# EAGLE design piezo-preamp-tickler_V3-7_single-supply-OPA1642 (EAGLE 8.6.0)

## Sheet 1 of 2
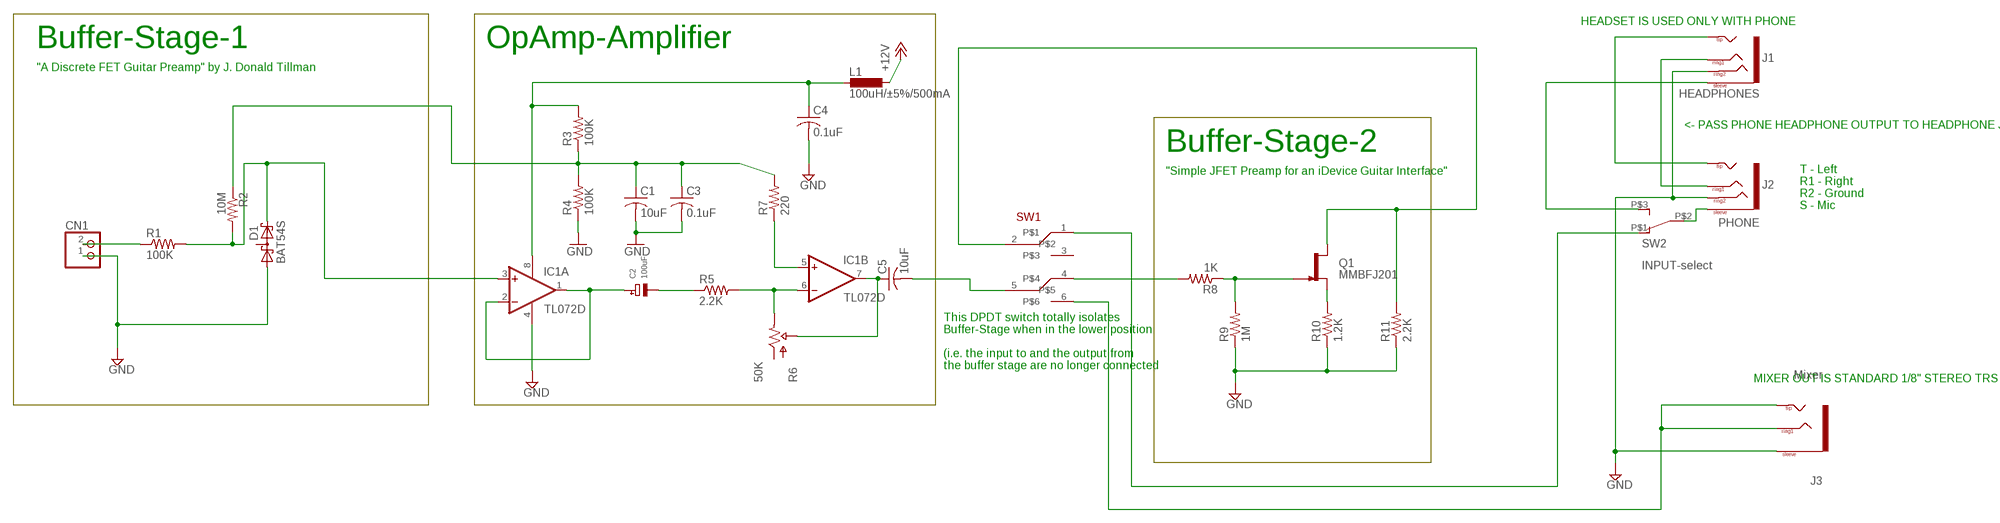
[diagram p0: schematic, sheet 1]

### Parts
C1  10uF  C-USC0805K  [C0805K]
C2  100uF  CAP_TANTALUMD/7343_REFLOW  [EIA7343-31/D-R]
C3  0.1uF  C-USC0805K  [C0805K]
C4  0.1uF  C-USC0805K  [C0805K]
C5  10uF  C-USC0805  [C0805]
CN1  JST_2PIN-THM  [JST-PH-2-THM]
D1  BAT54S  [SOT23]
IC1  TL072D  [SO08]
J1  HEADPHONES  TRRS-1/8"-3.5MMLGPADS  [TRRS_SJ-43514-SMT-TR]
J2  PHONE  TRRS-1/8"-3.5MMLGPADS  [TRRS_SJ-43514-SMT-TR]
J3  Mixer  TRS-1/8"-3.5MM  [TRS_SJ-3524-SMT]
L1  100uH/±5%/500mA  L-EUL3225M  [L3225M]
Q1  MMBFJ201  J201SOT-23  [SOT23-3]
R1  100K  R-US_R0603  [R0603]
R2  10M  R-US_R0603  [R0603]
R3  100K  R-US_R0603  [R0603]
R4  100K  R-US_R0603  [R0603]
R5  2.2K  R-US_R0603  [R0603]
R6  50K  POTTHUMBPOT14  [THUMBPOT14MM]
R7  220  R-US_R0603  [R0603]
R8  1K  R-US_R0603  [R0603]
R9  1M  R-US_R0603  [R0603]
R10  1.2K  R-US_R0603  [R0603]
R11  2.2K  R-US_R0603  [R0603]
SW1  SWITCH_DPDT  [SWITCH_DPDT_CL-SB-22B]
SW2  INPUT-select  SWITCH_SPDTCL-SB-12B  [SWITCH_SPDT_CL-SB-12B]

### Nets
+12V: L1.1 ; also sheet 2
GND: C1.2 C3.2 C4.2 CN1.1 D1.1(A1) IC1.4(P:V-) J1.RING2 J2.RING2 J3.1(SLEEVE) R4.1 R9.1 R10.1 R11.1 ; also sheet 2
N$1: D1.2(C2) IC1.3(A:+IN) R1.2 R2.2
N$2: CN1.2 R1.1
N$3: Q1.2(S) R10.2
N$4: J1.EARTH(SLEEVE) SW2.P$3
N$5: IC1.5(B:+IN) R7.1
N$6: C5.1 IC1.7(B:OUT) R6.P$2(WIPER)
N$7: IC1.6(B:-IN) R5.2 R6.P$3(OUT)
N$8: C4.1 IC1.8(P:V+) L1.2 R3.2
N$9: C1.1 C3.1 R2.1 R3.1 R4.2 R7.2
N$10: Q1.3(G) R8.1 R9.2
N$11: R8.2 SW1.4
N$12: J3.2(TIP) J3.3(RING1) J3.4(TIP) SW1.6
N$13: J1.RING1 J2.RING1
N$14: C2.- R5.1
N$16: C5.2 SW1.5
N$17: J2.EARTH(SLEEVE) SW2.P$2
N$19: SW1.1 SW2.P$1
N$24: C2.+ IC1.1(A:OUT) IC1.2(A:-IN)
N$33: J1.TIP J2.TIP
SELECT: Q1.1(D) R11.2 SW1.2
Unconnected: D1.3(C1A2) R6.P$1(IN) SW1.3

### Notes on the sheet
- HEADSET IS USED ONLY WITH PHONE
- Buffer-Stage-1 | OpAmp-Amplifier
- "A Discrete FET Guitar Preamp" by J. Donald Tillman
- <- PASS PHONE HEADPHONE OUTPUT TO HEADPHONE JACK
- Buffer-Stage-2
- "Simple JFET Preamp for an iDevice Guitar Interface"
- T - Left
  R1 - Right
  R2 - Ground
  S - Mic
- This DPDT switch totally isolates 
  Buffer-Stage when in the lower position
  
  (i.e. the input to and the output from 
  the buffer stage are no longer connected
- MIXER OUT IS STANDARD 1/8" STEREO TRS

## Sheet 2 of 2
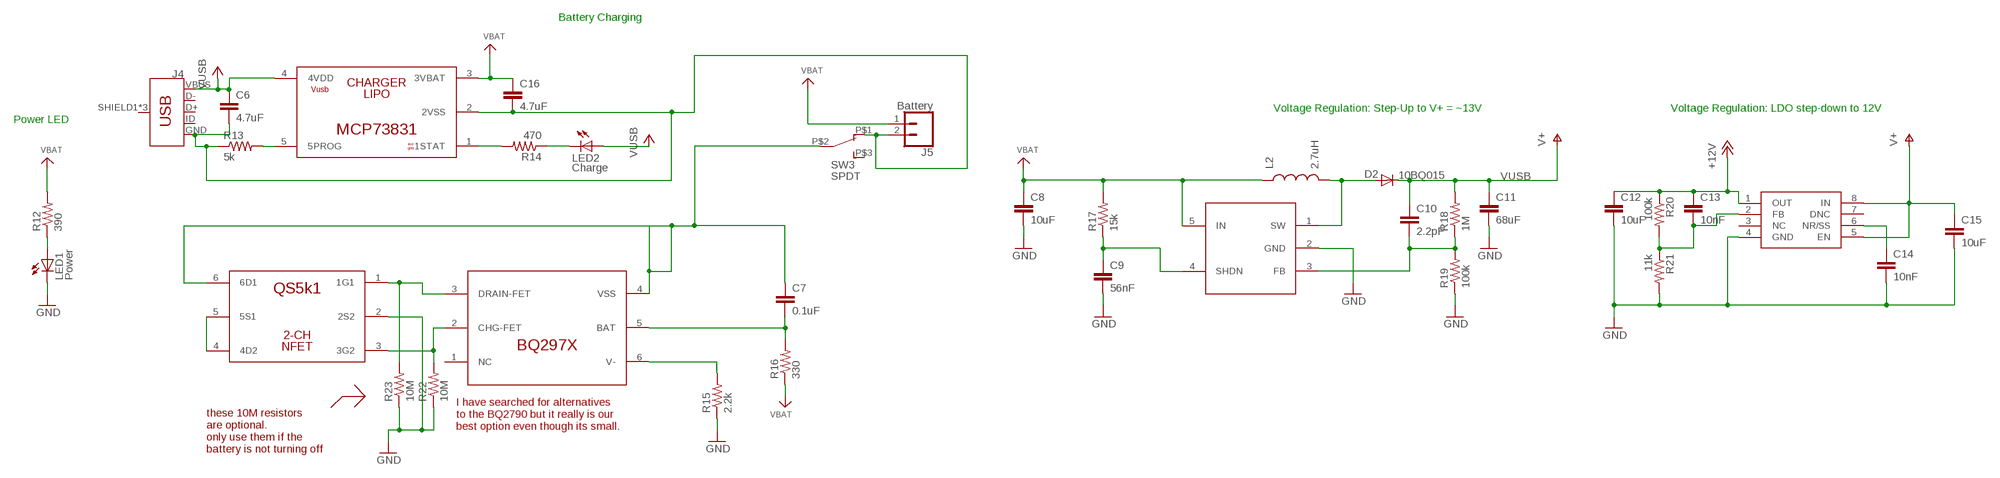
[diagram p1: schematic, sheet 2]

### Parts
C6  4.7uF  C-EUC0603  [C0603]
C7  0.1uF  C-EUC0603  [C0603]
C8  10uF  C-EUC0603  [C0603]
C9  56nF  C-EUC0603  [C0603]
C10  2.2pF  C-EUC0603  [C0603]
C11  68uF  C-EUC1206  [C1206]
C12  10uF  C-EUC0603  [C0603]
C13  10nF  C-EUC0603  [C0603]
C14  10nF  C-EUC0603  [C0603]
C15  10uF  C-EUC0603  [C0603]
C16  4.7uF  C-EUC0603  [C0603]
D2  10BQ015  DIODESMA  [SMA-DIODE]
IC2  MCP73831  [SOT-23-5]
IC3  QS6K1  [SOT457R_PHILIPS]
IC4  BQ297X  BQ297X-BATTERY-MANAGERLONG  [WSON-6-LONG]
IC5  SC4503  [SOT23-5]
IC6  TPS7A49  [MSOP-8]
J4  USB_MICRO-BREDUCED_PASTE  [USB-B-MICRO-SMD_RED_PASTE]
J5  Battery  CONN_02LOCK  [1X02_LOCK]
L2  2.7uH  INDUCTORCR54  [CR54]
LED1  Power  LED3MM  [LED3MM]
LED2  Charge  LED3MM  [LED3MM]
R12  390  R-US_R0603  [R0603]
R13  5k  R-US_R0603  [R0603]
R14  470  R-US_R0603  [R0603]
R15  2.2k  R-US_R0603  [R0603]
R16  330  R-US_R0603  [R0603]
R17  15k  R-US_R0603  [R0603]
R18  1M  R-US_R0603  [R0603]
R19  100k  R-US_R0603  [R0603]
R20  100k  R-US_R0603  [R0603]
R21  11k  R-US_R0603  [R0603]
R22  10M  R-US_R0603  [R0603]
R23  10M  R-US_R0603  [R0603]
SW3  SPDT  SWITCH_SPDTCL-SB-12B  [SWITCH_SPDT_CL-SB-12B]

### Nets
+5V: C6.1 IC2.4(4VDD) J4.VBUS LED2.A ; supply symbol labelled VUSB
+12V: C12.1 C13.1 IC6.1(OUT) R20.1 ; also sheet 1
BATGND: C7.1 IC3.6(6D1) IC4.4(VSS) SW3.P$2
GND: C8.2 C9.2 C11.2 C12.2 C14.2 C15.2 IC3.2(2S2) IC5.2(GND) IC6.4(GND) LED1.K(C) R15.1 R19.1 R21.2 R22.1 R23.1 ; also sheet 1
N$18: LED1.A R12.1
N$21: IC2.5(5PROG) R13.2
N$22: LED2.K(C) R14.1
N$23: IC3.4(4D2) IC3.5(5S1)
N$25: IC2.1(1STAT) R14.2
N$26: C13.2 IC6.2(FB) R20.2 R21.1
N$27: IC3.1(1G1) IC4.3(DRAIN-FET) R23.2
N$28: C14.1 IC6.6(NR/SS)
N$29: C9.1 IC5.4(SHDN) R17.1
N$30: C10.2 IC5.3(FB) R18.1 R19.2
N$31: IC3.3(3G2) IC4.2(CHG-FET) R22.2
N$32: D2.A IC5.1(SW) L2.P$2
N$34: IC4.6(V-) R15.2
N$42: C7.2 IC4.5(BAT) R16.2
USBGND: C6.2 C16.2 IC2.2(2VSS) J4.GND J5.2 R13.1 SW3.P$1
VBAT: C8.1 C16.1 IC2.3(3VBAT) IC5.5(IN) J5.1 L2.P$1 R12.2 R16.1 R17.2
VUSB: C10.1 C11.1 C15.1 D2.C IC6.5(EN) IC6.8(IN) R18.2 ; supply symbol labelled V+
Unconnected: IC4.1(NC) IC6.3(NC) IC6.7(DNC) J4.D+ J4.D- J4.ID J4.SHIELD1(SHIELD) J4.SHIELD2(SHIELD) J4.SHIELD3(SHIELD) SW3.P$3

### Notes on the sheet
- Battery Charging
- Voltage Regulation: Step-Up to V+ = ~13V | Voltage Regulation: LDO step-down to 12V
- Power LED
- I have searched for alternatives 
  to the BQ2790 but it really is our 
  best option even though its small.
- these 10M resistors
  are optional. 
  only use them if the 
  battery is not turning off

## Library data of the parts
C1 C3-C5 = adafruit:C-US: CAPACITOR, American symbol
C2 = microbuilder:CAP_TANTALUM: Tantalum Capacitors Wave footprints have larger pads and are meant to be used for hand soldering. Reflow footprints are optimised for solder paste and a reflow oven. EIA3216-18/A-[R/W] - Size A / 3216-18 / 1206 footprint 4.7µF 25V 10% Tantalum Capacitor 10µF 16V 10% Tantalum Capacitor [Digikey: 495-2236-2-ND] EIA3528-21/B-[R/W] - Size B / 3528-21 47µF 10V 10% Tantalum Capactior [Digikey: 495-2216-1-ND] EIA6032-28/C-[R/W] - Size C / 6032-28 10µF 35V 20% Tantalum Capacitor [Digikey: 495-2285-1-ND] 100µF 16V 10% Tantalum Capactior [Digikey: 399-5214-1-ND]
C6-C16 = rcl:C-EU: CAPACITOR, European symbol; SPICEPREFIX: C
CN1 = adafruit:JST_2PIN: JST 2-Pin Connectors of various flavors SMT-RA (S2B-PH-SM4) 4UConnector #17311 SMT (B2B-PH-SM4) THM-RA (S2B-PH) THM (B2B-PH)
D1 = diode:BAT54S: Schottky Diodes Pin connection corrected 2011-05-04 Source: Fairchild .. BAT54.pdf
D2 = SparkFun:DIODE: Diode These are standard reverse protection diodes and small signal diodes. SMA package can handle up to about 1A. SOD-323 can handle about 200mA. What the SOD-323 package when ordering, there are some mfgs out there that are 5-pin packages.
IC1 = linear:TL072: OP AMP
IC2 = CMU-ArtFab:MCP73831
IC3 = CMU-ArtFab:QS6K1
IC4 = CMU-ArtFab:BQ297X-BATTERY-MANAGER
IC5 = CMU-ArtFab:SC4503
IC6 = CMU-ArtFab:TPS7A49
J1 J2 = CMU-ArtFab:TRRS-1/8"-3.5MM: Audio jack - 3.5mm TRRS variety - two rings.
J3 = CMU-ArtFab:TRS-1/8"-3.5MM
J4 = CMU-ArtFab:USB_MICRO-B: USB Type Micro-B Connector Male/female and PTH/SMT variants SparkFun Products: SparkFun microB USB Breakout <https://www.sparkfun.com/products/12035> SparkFun USB microB Plug Breakout <https://www.sparkfun.com/products/10031> SparkFun ESP8266 Thing <https://www.sparkfun.com/products/13231>; PROD_ID: CONN-11752
J5 = SparkFun-Connectors:CONN_02: Multi connection point. Often used as Generic Header-pin footprint for 0.1 inch spaced/style header connections On any of the 0.1 inch spaced packages, you can populate with these: Break Away Headers - Straight <https://www.sparkfun.com/products/116> (PRT-00116) Break Away Male Headers - Right Angle <https://www.sparkfun.com/products/553> (PRT-00553) Female Headers <https://www.sparkfun.com/products/115> (PRT-00115) Break Away Headers - Machine Pin <https://www.sparkfun.com/products/117> (PRT-00117) Break Away Female Headers - Swiss Machine Pin <https://www.sparkfun.com/products/743> (PRT-00743) For SCREWTERMINALS and SPRING TERMINALS visit here: Screw Terimnals on SparkFun.com <https://www.sparkfun.com/search/results?term=Screw+Terminals> (5mm/3.5mm/2.54mm spacing) This device is also useful as a general connection point to wire up your design to another part of your project. Our various solder wires solder well into these plated through hole pads. Hook-Up Wire - Assortment (Stranded, 22 AWG) <https://www.sparkfun.com/products/11375> (PRT-11375) Hook-Up Wire - Assortment (Solid Core, 22 AWG) <https://www.sparkfun.com/products/11367> (PRT-11367) View the entire wire category on our website here <https://www.sparkfun.com/categories/141> Special notes: Molex polarized connector foot print use with: PRT-08233 with associated crimp pins and housings. 2.54_SCREWTERM for use with PRT-10571. 3.5mm Screw Terminal footprints for PRT-08084 5mm Screw Terminal footprints for use with PRT-08432
L1 = rcl:L-EU: INDUCTOR, European symbol; SPICEPREFIX: L
L2 = SparkFun-Passives:INDUCTOR: Inductors Basic Inductor/Choke - 0603 and 1206. Footprints are not proven and vary greatly between part numbers. SRN6045- 33uH, 20% 1.4A SDR0403-560KL - 56uH, 10%, 500mA RMS/740mA peak
LED1 LED2 = led:LED: LED OSRAM: - CHIPLED LG R971, LG N971, LY N971, LG Q971, LY Q971, LO R971, LY R971 LH N974, LH R974 LS Q976, LO Q976, LY Q976 LO Q996 - Hyper CHIPLED LW Q18S LB Q993, LB Q99A, LB R99A - SideLED LS A670, LO A670, LY A670, LG A670, LP A670 LB A673, LV A673, LT A673, LW A673 LH A674 LY A675 LS A676, LA A676, LO A676, LY A676, LW A676 LS A679, LY A679, LG A679 - Hyper Micro SIDELED® LS Y876, LA Y876, LO Y876, LY Y876 LT Y87S - SmartLED LW L88C, LW L88S LB L89C, LB L89S, LG L890 LS L89K, LO L89K, LY L89K LS L896, LA L896, LO L896, LY L896 - TOPLED LS T670, LO T670, LY T670, LG T670, LP T670 LSG T670, LSP T670, LSY T670, LOP T670, LYG T670 LG T671, LOG T671, LSG T671 LB T673, LV T673, LT T673, LW T673 LH T674 LS T676, LA T676, LO T676, LY T676, LB T676, LH T676, LSB T676, LW T676 LB T67C, LV T67C, LT T67C, LS T67K, LO T67K, LY T67K, LW E67C LS E67B, LA E67B, LO E67B, LY E67B, LB E67C, LV E67C, LT E67C LW T67C LS T679, LY T679, LG T679 LS T770, LO T770, LY T770, LG T770, LP T770 LB T773, LV T773, LT T773, LW T773 LH T774 LS E675, LA E675, LY E675, LS T675 LS T776, LA T776, LO T776, LY T776, LB T776 LHGB T686 LT T68C, LB T68C - Hyper Mini TOPLED® LB M676 - Mini TOPLED Santana® LG M470 LS M47K, LO M47K, LY M47K Source: http://www.osram.convergy.de LUXEON: - LUMILED® LXK2-PW12-R00, LXK2-PW12-S00, LXK2-PW14-U00, LXK2-PW14-V00 LXK2-PM12-R00, LXK2-PM12-S00, LXK2-PM14-U00 LXK2-PE12-Q00, LXK2-PE12-R00, LXK2-PE12-S00, LXK2-PE14-T00, LXK2-PE14-U00 LXK2-PB12-K00, LXK2-PB12-L00, LXK2-PB12-M00, LXK2-PB14-N00, LXK2-PB14-P00, LXK2-PB14-Q00 LXK2-PR12-L00, LXK2-PR12-M00, LXK2-PR14-Q00, LXK2-PR14-R00 LXK2-PD12-Q00, LXK2-PD12-R00, LXK2-PD12-S00 LXK2-PH12-R00, LXK2-PH12-S00 LXK2-PL12-P00, LXK2-PL12-Q00, LXK2-PL12-R00 Source: www.luxeon.com KINGBRIGHT: KA-3528ASYC Source: www.kingbright.com
Q1 = CMU-ArtFab:J201: N-channel JFET
R1-R5 R7-R23 = CMU-ArtFab:R-US_: RESISTOR, American symbol
R6 = CMU-ArtFab:POT: http://www.taydaelectronics.com/10k-ohm-linear-taper-potentiometer-round-shaft-pcb-9mm.html http://www.taydaelectronics.com/datasheets/A-1847.pdf
SW1 = CMU-ArtFab:SWITCH_DPDT
SW2 SW3 = CMU-ArtFab:SWITCH_SPDT

## Board
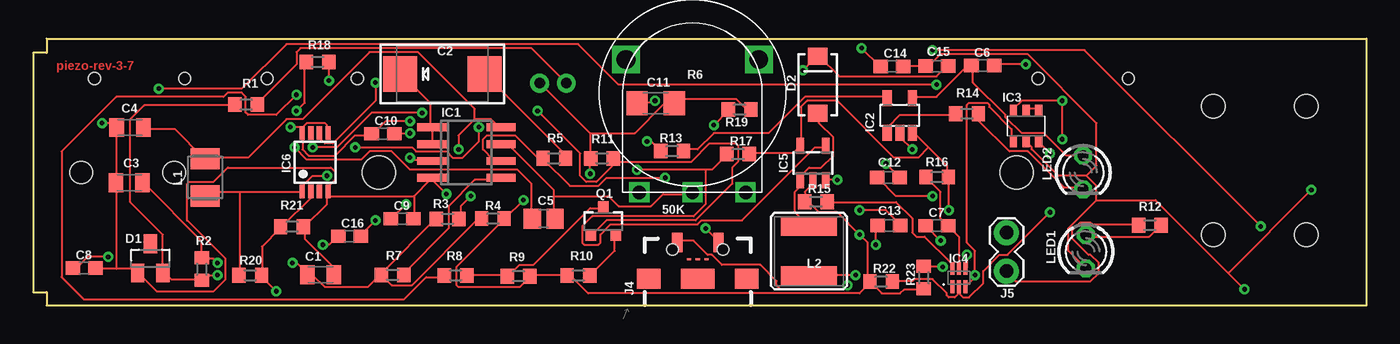
[diagram p2: board, top side]
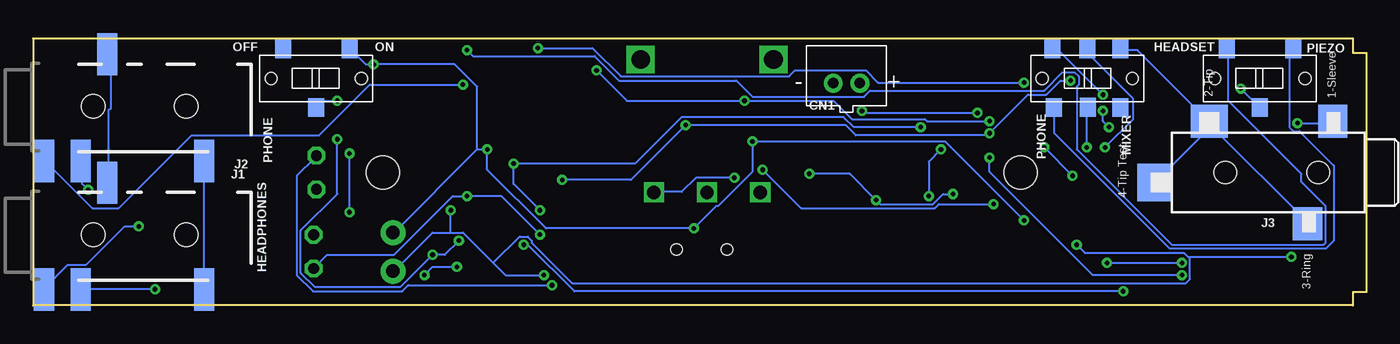
[diagram p3: board, bottom side, seen from below]

Size 100.3 x 20.07 mm. Coordinates in mm from the lower left corner, seen from the top.
Outline: 0,19 0,1 1.02,1 1.02,0 100.3,0 100.3,20.07 1,20.07 1,19 0,19
Copper layers (1*16): Top 0.035mm / dielectric 1.5mm / Bottom 0.035mm
Design rules "default *": minimum track width 6mil, minimum drill 0.35mm, track to track 6mil, track to pad 6mil, pad to pad 6mil, via to via 6mil, smd to smd 6mil, copper to edge 8mil, drill to drill 6mil, minimum pad ring 10mil, minimum via ring 8mil, stop-mask expansion 4mil, vias tented up to drill 20mil, thermal gap 10mil
Holes 2.5 mm at 74,10 26,10

### Footprints (pad centres in the part's own frame; a part is rotated, then mirrored left to right if it is on the bottom)
C0805K = smd 1.1 x 1.4: 1 -1,0; 2 1,0
EIA7343-31/D-R = smd 2.55 x 2.7: + 3.175,0; - -3.175,0
C0805 = smd 1.3 x 1.5: 1 -0.85,0; 2 0.85,0
C0603 = smd 1.1 x 1: 1 -0.85,0; 2 0.85,0
C1206 = smd 1.6 x 1.8: 1 -1.4,0; 2 1.4,0
JST-PH-2-THM = drill 0.8 pad 1.422: 1 1,0; 2 -1,0
SOT23 = smd 1 x 1.4: 1 -0.95,-1.1; 2 0.95,-1.1; 3 0,1.1
SMA-DIODE = smd 1.27 x 1.47: A -2.15,0; C 2.15,0
SO08 = smd 0.6 x 2.2: 1 -1.905,-2.6; 2 -0.635,-2.6; 3 0.635,-2.6; 4 1.905,-2.6; 5 1.905,2.6; 6 0.635,2.6; 7 -0.635,2.6; 8 -1.905,2.6
SOT-23-5 = smd 0.69 x 1.2: 1 -0.95,-1.3; 2 0,-1.3; 3 0.95,-1.3; 4 0.95,1.3; 5 -0.95,1.3
SOT457R_PHILIPS = smd 0.55 x 0.8: 1 -0.95,-1.2; 2 0,-1.2; 3 0.95,-1.2; 4 0.95,1.2; 5 0,1.2; 6 -0.95,1.2
WSON-6-LONG = smd 0.3 x 0.954: 1 -0.5,-0.686; 2 0,-0.686; 3 0.5,-0.686; 4 0.5,0.686; 5 0,0.686; 6 -0.5,0.686
SOT23-5 = smd 0.55 x 1.2: 1 -0.95,-1.3; 2 0,-1.3; 3 0.95,-1.3; 4 0.95,1.3; 5 -0.95,1.3
MSOP-8 = smd 0.4 x 1: 1 -0.975,-2.2; 2 -0.325,-2.2; 3 0.325,-2.2; 4 0.975,-2.2; 5 0.975,2.2; 6 0.325,2.2; 7 -0.325,2.2; 8 -0.975,2.2
TRRS_SJ-43514-SMT-TR = smd 1.524 x 3.175: EARTH -7.067,-4.128; RING1 -2.309,3.901; RING2 -4.293,-4.128; TIP 4.995,-4.128 | hole 1.778: -3.353,-0.007; 3.647,-0.007
TRS_SJ-3524-SMT = smd 2.5 x 2.2: 1 3.85,-4.6; 3 -3.85,-2.7 | smd 2.5 x 2.8: 2 3.85,4.7 | smd 2.8 x 2.5: 4 -0.75,8.85 | hole 1.7: 0,-3.5; 0,3.5
USB-B-MICRO-SMD_RED_PASTE = smd 0.152 x 0.305: D+ 1.455,0; D- 1.455,0.65; ID 1.455,-0.65 | smd 1.45 x 0.762: GND 2.725,-1.554 | smd 1.5 x 1.8: SHIELD1 0,3.685; SHIELD2 0,-3.685 | smd 1.5 x 2.5: SHIELD3 0,0 | smd 1.45 x 0.781: VBUS 2.725,1.554 | hole 0.85: 2.2,1.9; 2.2,-1.9
1X02_LOCK = drill 1.016 pad 1.88: 1 -0.178,0; 2 2.718,0
L3225M = smd 1.6 x 2.2: 1 -1.4,0; 2 1.4,0
CR54 = smd 4.2 x 1.4: P$1 0,1.85; P$2 0,-1.85
LED3MM = drill 0.813 octagon: A -1.27,0; K 1.27,0
SOT23-3 = smd 0.8 x 0.9: 1 -0.95,-1; 2 0.95,-1; 3 0,1.1
R0603 = smd 1 x 1.1: 1 -0.85,0; 2 0.85,0
THUMBPOT14MM = drill 1 square: P$1 -4,-7.5; P$2 0,-7.5; P$3 4,-7.5 | drill 1.4 square: P$4 -5,2.5; P$5 5,2.5
SWITCH_DPDT_CL-SB-22B = smd 1.2 x 1.4: 1 -2.5,-2.2; 2 0.05,-2.17; 3 2.5,-2.2; 4 -2.63,2.2; 5 0,2.2; 6 2.51,2.2 | hole 0.9: -3.4,0; 3.4,0
SWITCH_SPDT_CL-SB-12B = smd 1.2 x 1.4: P$1 -2.5,-2.2; P$2 0,2.2; P$3 2.5,-2.2 | hole 0.9: -3.4,0; 3.4,0

### Placement (x,y rotation side)
C1  21.62,2.31 0 top
C2  30.78,17.41 180 top
C3  7.23,9.23 180 top
C4  7.29,13.38 180 top
C5  38.41,6.53 180 top
C6  71.44,18.04 0 top
C7  68,6 0 top
C8  3.83,2.81 0 top
C9  27.76,6.52 0 top
C10  26.31,12.91 0 top
C11  46.83,15.2 0 top
C12  64.35,9.63 180 top
C13  64.39,6.02 180 top
C14  64.62,17.98 0 top
C15  68,18 180 top
C16  23.8,5.2 0 top
CN1  39.11,16.72 0 bottom
D1  8.81,3.54 0 top
D2  59.04,16.61 90 top
IC1  32.6,11.5 270 top
IC2  65.2,14.3 0 top
IC3  74.7,13.5 0 top
IC4  69.65,2.09 0 top
IC5  58.67,10.72 0 top
IC6  21.21,10.78 0 top
J1  92.43,5.33 0 bottom
J2  92.43,14.99 0 bottom
J3  7.11,10 90 bottom
J4  50,2.02 90 top
J5  73.23,2.75 90 top
L1  12.94,9.64 90 top
L2  58.37,4.09 180 top
LED1  79.2,4.05 270 top
LED2  79,10 270 top
Q1  42.9,6.3 0 top
R1  16.03,15.11 180 top
R2  12.68,2.74 270 top
R3  31.18,6.51 0 top
R4  34.58,6.54 180 top
R5  39.2,11.07 180 top
R6  49.6,16 0 top
R7  27.04,2.31 180 top
R8  31.78,2.26 180 top
R9  36.52,2.2 180 top
R10  41.02,2.24 0 top
R11  42.79,11.07 0 top
R12  84.02,6.03 180 top
R13  48.08,11.62 0 top
R14  70.26,14.42 180 top
R15  58.9,7.8 0 top
R16  68.01,9.66 180 top
R17  53.03,11.38 0 top
R18  21.39,18.31 180 top
R19  53.15,14.74 180 top
R20  16.34,2.27 0 top
R21  19.47,5.92 0 top
R22  63.8,1.8 0 top
R23  67,2.1 90 top
SW1  21,17.08 0 bottom
SW2  8,17.08 180 bottom
SW3  79,17.08 180 bottom

### Tracks (layer width: path | path; a pad name or v marks a point on that pad's centre or on a via)
+5V  (via drill 0.35)
  Top 0.152: IC2.4 66.29,15.7 67.97,15.7 70.26,17.98 70.56,17.98 C6.1 70.71,17.98 70.71,16.76 73.15,14.33 73.15,14.17 74.37,12.95 76.05,12.95 77.72,11.28 78.94,11.28 LED2.A | v61.27,1.52 60.96,1.22 56.24,1.22 55.93,1.52 55.93,1.83 54.71,3.05 51.82,3.05 51.05,3.81 50.75,3.81 49.68,4.88 48.46,4.88 J4.VBUS
  Bottom 0.152: v61.27,1.52 72.08,1.52 72.54,1.07 79.25,1.07 80.47,2.29 80.47,9.75 79.1,11.12 LED2.A
+12V  (via drill 0.35)
  Top 0.152: v64.16,10.67 65.08,9.75 C12.1 | v62.18,7.16 64.16,7.16 65.23,6.1 C13.1 | 15.54,8.53 13.11,8.53 12.95,8.38 L1.1 | 15.54,8.53 20.12,8.53 IC6.1 20.27,8.69 20.27,8.99 21.03,9.75 v22.1,9.75 | 15.54,8.53 15.54,2.29 R20.1 | v33.53,13.41 33.53,12.34 32.31,11.12 31.55,11.12 31.09,11.58 28.8,11.58 28.5,11.89 v24.23,11.89
  Bottom 0.152: v62.18,7.16 64.16,9.14 v64.16,10.67 55.02,10.67 51.51,14.17 39.32,14.17 38.56,13.41 v33.53,13.41 | v22.1,9.75 v24.23,11.89
BATGND  (via drill 0.35)
  Top 0.152: IC3.6 73.76,14.78 74.37,15.39 v77.42,15.39 v77.42,12.5 | v70.26,3.81 70.26,2.9 IC4.4 | v68.28,4.88 67.21,5.94 C7.1
  Bottom 0.152: v77.42,15.39 78.49,15.39 78.94,14.94 SW3.P$2 | v68.28,4.88 69.34,3.81 v70.26,3.81 72.69,1.37 79.1,1.37 80.16,2.44 80.16,5.64 77.42,8.38 v77.42,12.5
GND  (via drill 0.35)
  Top 0.152: C14.2 65.53,17.98 67.06,17.98 C15.2 67.21,18.14 67.51,18.14 68.28,18.9 74.83,18.9 80.01,13.72 80.01,10.52 79.25,9.75 | 79.25,9.75 77.11,9.75 75.13,11.73 75.13,11.89 74.83,12.19 IC3.2 | 79.25,9.75 80.01,8.99 80.01,7.92 | 80.01,7.92 77.88,5.79 77.88,4.12 79.1,2.9 LED1.K | v67.67,8.23 64.92,8.23 63.55,9.6 C12.2 | 89.92,2.44 84.43,7.92 80.01,7.92 | 89.92,2.44 v91.14,1.22 | 89.92,2.44 v96.16,8.69 | 28.65,8.23 28.65,6.55 C9.2 | 28.65,8.23 29.87,9.45 IC1.4 30.02,9.45 v31.09,8.38 | 22.1,8.23 22.1,7.62 20.42,5.94 R21.2 20.42,5.79 20.42,5.03 22.55,2.9 22.55,2.44 C1.2 | 22.1,8.23 22.1,8.53 IC6.4 | 22.1,8.23 28.65,8.23 | 22.1,8.23 IC6.4 | 6.25,2.74 7.62,2.74 7.77,2.59 D1.1 7.92,2.44 9.3,1.07 13.56,1.07 14.48,1.98 14.48,3.5 11.58,6.4 11.58,9.14 11.73,9.3 13.56,9.3 14.63,10.36 22.4,10.36 22.71,10.06 22.71,9.45 22.25,8.99 22.25,8.69 IC6.4 | 6.25,2.74 4.72,2.74 C8.2 | 6.25,2.74 6.25,9.14 C3.2 6.25,9.3 6.25,13.26 C4.2 6.25,13.41 5.94,13.72 v5.18,13.72 | R19.1 53.95,14.78 53.65,14.78 52.88,15.54 48.62,15.54 48.31,15.24 C11.2 48.16,15.09 47.4,15.09 45.26,12.95 41.91,12.95 | 41.91,12.95 41.91,11.12 R11.1 41.91,10.97 v41.91,9.91 | 41.91,12.95 38.25,16.61 CN1.1 | IC5.2 58.52,9.3 58.52,8.99 58.06,8.53 58.06,7.92 R15.1 58.06,7.77 58.37,7.77 59.13,7.01 60.5,7.01 v62.18,5.33 62.79,4.72 62.79,1.98 62.94,1.83 R22.1 | R23.1 66.9,1.22 65.53,1.22 65.23,0.91 63.86,0.91 63.09,1.68 R22.1 | R22.1 62.94,1.68 62.18,0.91 41.76,0.91 40.54,2.13 40.23,2.13 R10.1 40.08,2.29 37.49,2.29 R9.1 37.34,2.13 36.58,1.37 32,1.37 31.85,1.52 31.85,2.9 35.36,6.4 R4.1 35.51,6.55 v36.88,7.92
  Bottom 0.152: LED1.K 79.1,2.9 78.18,3.81 73.15,3.81 68.73,8.23 v67.67,8.23 65.08,8.23 v62.18,5.33 | v91.14,1.22 96.62,1.22 J1.RING2 | v96.16,8.69 96.62,9.14 96.62,10.82 J2.RING2 | v5.18,13.72 2.59,13.72 J3.1 | v41.91,9.91 38.86,9.91 v36.88,7.92 36.58,7.62 32.61,7.62 31.85,8.38 v31.09,8.38
N$1  (via drill 0.35)
  Top 0.152: R1.2 15.09,15.09 8.38,15.09 7.32,14.02 7.32,7.77 9.75,5.33 9.75,2.59 D1.2 9.91,2.44 10.36,1.98 12.65,1.98 R2.2 12.8,1.98 13.11,2.29 v13.87,2.29 | v28.35,11.12 28.5,10.97 29.87,10.97 IC1.3
  Bottom 0.152: v28.35,11.12 28.35,10.06 20.57,2.29 v13.87,2.29
N$2
  Top 0.152: R1.1 16.92,15.24 19.81,18.14 19.81,19.05 20.12,19.36 37.49,19.36 40.08,16.76 CN1.2
N$3
  Top 0.152: Q1.2 43.74,5.18 43.74,4.12 41.91,2.29 R10.2
N$4  (via drill 0.35)
  Top 0.152: v67.67,19.2 79.1,19.2 v92.35,5.94
  Bottom 0.152: v67.67,19.2 67.21,18.75 58.06,18.75 56.24,16.92 47.4,16.92 46.18,15.7 37.8,15.7 37.34,16.15 24.23,16.15 22.86,17.53 21.95,17.53 21.64,17.22 21.64,16.61 21.79,16.46 21.79,11.73 14.63,4.57 3.2,4.57 3.05,4.72 3.05,7.47 4.88,9.3 4.88,9.91 10.36,15.39 10.36,19.2 SW2.P$3 | v92.35,5.94 93.42,5.94 96.32,3.05 97.69,3.05 99.52,1.22 J1.EARTH
N$5
  Top 0.152: R7.1 27.89,2.44 31.24,5.79 31.24,7.47 33.22,9.45 35.05,9.45 IC1.5
N$6
  Top 0.152: 39.17,8.23 39.17,8.69 35.81,12.04 35.2,12.04 IC1.7 | 39.17,8.23 39.17,6.55 C5.1 | 39.17,8.23 43.28,8.23 44.04,7.47 46.48,7.47 47.4,8.38 49.53,8.38 R6.P$2
N$7  (via drill 0.35)
  Top 0.152: IC1.6 35.05,10.97 34.59,10.97 33.83,11.73 33.83,12.5 34.14,12.8 36.27,12.8 37.95,11.12 38.25,11.12 R5.2 38.41,10.97 40.39,8.99 42.52,8.99 43.13,9.6 v47.55,9.6
  Bottom 0.152: v47.55,9.6 50.44,9.6 51.51,8.53 53.49,8.53 R6.P$3
N$8  (via drill 0.35)
  Top 0.152: C4.1 8.38,13.26 10.67,13.26 12.8,11.12 L1.2 12.95,11.12 16.15,11.12 19.05,14.02 20.27,14.02 25.3,19.05 28.96,19.05 33.22,14.78 33.22,14.02 | v32.92,8.23 32.16,7.47 32.16,6.55 R3.2 | v32,11.73 32,12.8 33.22,14.02 | 33.22,14.02 34.44,14.02 35.05,13.41 IC1.8
  Bottom 0.152: v32.92,8.23 32.92,10.82 v32,11.73
N$9  (via drill 0.35)
  Top 0.152: C3.1 8.38,9.14 12.65,4.88 12.65,3.66 R2.1 12.8,3.5 13.56,3.5 v13.87,3.2 | R7.2 26.21,2.44 30.33,6.55 R3.1 | R4.2 33.68,6.4 33.38,6.4 28.5,1.52 26.98,1.52 26.21,2.29 R7.2 | R7.2 26.06,2.29 25.15,1.37 21.95,1.37 21.03,2.29 20.73,2.29 C1.1 20.57,2.44 19.81,3.2 v19.51,3.2
  Bottom 0.152: v19.51,3.2 v13.87,3.2
N$10
  Top 0.152: Q1.3 42.82,7.32 41.91,7.32 37.64,3.05 36.58,3.05 35.81,2.29 R9.2 35.66,2.29 32.77,2.29 R8.1
N$11  (via drill 0.35)
  Top 0.152: v19.81,15.85 18.29,14.33 16.15,14.33 16,14.48 16,15.7 15.7,16 14.63,16 14.33,15.7 6.25,15.7 2.13,11.58 2.13,2.13 3.81,0.46 27.89,0.46 29.57,2.13 30.79,2.13 R8.2
  Bottom 0.152: v19.81,15.85 23.16,19.2 23.62,19.2 SW1.4
N$12
  Bottom 0.152: SW1.6 18.44,19.2 17.22,19.2 11.89,13.87 J3.2 | 11.58,13.41 11.89,13.72 J3.2 | 11.58,13.41 4.42,6.25 J3.3 | 11.58,13.41 11.73,13.41 15.85,9.3 J3.4 | 11.58,13.41 J3.2
N$13
  Bottom 0.152: J1.RING1 94.64,9.3 94.64,14.63 94.49,14.78 94.49,18.59 94.64,18.75 J2.RING1
N$14
  Top 0.152: R5.1 39.93,11.12 39.93,11.43 33.98,17.37 C2.-
N$16  (via drill 0.35)
  Top 0.152: v19.66,11.89 20.57,10.97 24.69,10.97 25.3,11.58 26.98,11.58 28.35,10.21 36.42,10.21 37.49,9.14 37.49,6.55 C5.2
  Bottom 0.152: v19.66,11.89 17.53,14.02 17.53,15.54 20.88,18.9 20.88,19.2 SW1.5
N$17  (via drill 0.35)
  Top 0.152: v9.45,16.31 15.7,16.31 19.05,19.66 41,19.66 44.04,16.61 v67.97,16.61
  Bottom 0.152: v9.45,16.31 8.08,14.94 SW2.P$2 | v67.97,16.61 74.98,16.61 78.79,12.8 88.39,12.8 93.88,7.32 95.86,7.32 99.36,10.82 J2.EARTH
N$18
  Top 0.152: R12.1 84.73,5.94 83.97,5.18 79.25,5.18 LED1.A
N$19
  Bottom 0.152: SW1.1 23.47,14.78 23.47,12.95 14.78,4.27 3.05,4.27 2.44,4.88 2.44,10.52 5.03,13.11 5.49,13.11 5.79,13.41 5.79,19.05 5.64,19.2 SW2.P$1
N$21
  Top 0.152: R13.2 49.07,11.73 49.99,11.73 51.21,12.95 55.32,12.95 58.06,15.7 64.16,15.7 IC2.5
N$22
  Top 0.152: R14.1 71.17,14.33 71.17,13.87 73.46,11.58 74.83,11.58 77.57,8.84 78.94,8.84 LED2.K
N$23
  Top 0.152: IC3.5 74.83,14.78 75.59,14.78 IC3.4
N$24
  Top 0.152: IC1.2 30.02,12.19 30.02,13.26 IC1.1 29.87,13.41 29.87,15.24 27.74,17.37 C2.+
N$25
  Top 0.152: R14.2 69.34,14.33 65.23,14.33 64.31,13.41 64.31,13.11 IC2.1
N$26  (via drill 0.35)
  Top 0.152: IC6.2 20.88,8.53 20.88,8.08 18.75,5.94 R21.1 18.59,5.79 17.22,4.42 17.22,2.29 R20.2 17.22,2.13 v18.29,1.07 | v63.4,4.57 63.4,5.94 C13.2
  Bottom 0.152: v63.4,4.57 63.09,4.57 59.59,1.07 v18.29,1.07
N$27  (via drill 0.35)
  Top 0.152: IC3.1 73.61,12.34 73.61,13.26 71.93,14.94 71.93,15.09 71.78,15.24 70.41,15.24 70.26,15.09 70.26,4.72 70.87,4.12 v70.87,2.29 70.87,2.13 70.26,1.52 IC4.3 | v68.43,2.9 67.06,2.9 R23.2
  Bottom 0.152: v68.43,2.9 70.26,2.9 v70.87,2.29
N$28  (via drill 0.35)
  Top 0.152: v25.76,16.76 25.76,15.39 22.55,12.19 21.95,12.19 21.64,12.5 21.64,12.95 IC6.6 | v62.33,19.36 63.7,17.98 C14.1
  Bottom 0.152: v25.76,16.76 36.73,16.76 37.64,17.68 42.98,17.68 43.43,17.22 56.08,17.22 58.22,19.36 v62.33,19.36
N$29  (via drill 0.35)
  Top 0.152: v28.04,7.62 26.98,6.55 C9.1 | 50.6,10.21 51.05,10.21 52.12,11.28 R17.1 | 50.6,10.21 v45.41,10.21 | 50.6,10.21 50.6,7.62 49.68,6.71 42.06,6.71 41.3,5.94 41.3,4.72 41.45,4.57 42.52,4.57 42.67,4.72 42.67,5.33 43.43,6.1 49.99,6.1 50.29,6.4 53.34,6.4 58.83,11.89 59.59,11.89 IC5.4
  Bottom 0.152: v28.04,7.62 32.16,7.62 32.46,7.32 42.52,7.32 v45.41,10.21
N$30  (via drill 0.35)
  Top 0.152: v22.25,16.92 22.25,18.29 R18.1 | v28.35,12.95 27.28,12.95 C10.2 | v51.21,13.56 52.27,14.63 R19.2 | v60.5,9.45 59.74,9.45 IC5.3
  Bottom 0.152: v22.25,16.92 23.01,16.92 24.08,15.85 25.45,15.85 v28.35,12.95 28.5,12.8 38.41,12.8 39.17,13.56 v51.21,13.56 55.32,9.45 v60.5,9.45
N$31  (via drill 0.35)
  Top 0.152: v76.5,11.43 75.74,12.19 IC3.3 | v76.5,7.01 73.3,3.81 72.69,3.81 71.48,2.59 71.48,1.68 70.41,0.61 69.95,0.61 69.65,0.91 | 69.65,0.91 69.65,1.37 IC4.2 | 69.65,0.91 69.34,0.61 68.89,0.61 68.73,0.76 68.73,0.91 67.67,1.98 66.29,1.98 66.14,1.83 64.77,1.83 R22.2
  Bottom 0.152: v76.5,7.01 v76.5,11.43
N$32
  Top 0.152: L2.P$2 57.3,7.01 57.3,8.53 57.61,8.84 57.61,9.3 IC5.1 57.76,9.45 57.76,9.75 58.37,10.36 59.28,10.36 60.2,11.28 60.2,12.65 59.13,13.72 59.13,14.33 D2.A
N$33
  Bottom 0.152: J1.TIP 87.48,1.22 87.48,10.82 J2.TIP
N$34
  Top 0.152: IC4.6 69.04,2.9 69.04,3.2 67.06,5.18 66.45,5.18 66.14,5.49 66.14,6.55 64.92,7.77 59.89,7.77 R15.2
N$42
  Top 0.152: IC4.5 69.65,2.9 69.65,5.18 68.89,5.94 C7.2 68.73,6.1 68.28,6.55 68.28,8.53 67.21,9.6 R16.2
SELECT  (via drill 0.35)
  Top 0.152: 43.89,10.82 49.53,10.82 50.9,12.19 52.88,12.19 53.03,12.04 53.03,10.82 52.58,10.36 52.58,9.14 49.84,6.4 43.13,6.4 42.06,5.33 Q1.1 | 43.89,10.82 43.74,10.97 R11.2 43.89,10.82 | v21.03,11.89 22.86,11.89 25.45,14.48 v29.26,14.48 | v37.95,14.63 41.15,11.43 41.15,9.75 41.6,9.3 42.37,9.3 43.89,10.82
  Bottom 0.152: v21.03,11.89 21.03,14.78 SW1.2 | v29.26,14.48 37.8,14.48 v37.95,14.63
USBGND  (via drill 0.35)
  Top 0.152: v74.68,18.14 72.39,18.14 C6.2 | v66.14,11.73 65.23,12.65 65.23,12.95 IC2.2 | v25.76,6.4 24.69,5.33 C16.2 | v46.18,12.34 46.48,12.34 47.09,11.73 R13.1 | v50.6,5.79 51.51,4.88 J4.GND
  Bottom 0.152: SW3.P$1 76.35,19.2 75.29,18.14 v74.68,18.14 68.58,18.14 66.9,16.46 66.9,11.73 | 66.9,11.73 v66.14,11.73 66.14,10.21 61.72,5.79 v50.6,5.79 48.92,7.47 48.77,7.47 46.18,10.06 v46.18,12.34 31.7,12.34 v25.76,6.4 | 66.9,11.73 73.15,5.49 J5.2
VBAT  (via drill 0.35)
  Top 0.152: v5.64,3.66 4.12,3.66 3.35,2.9 3.05,2.9 C8.1 | v21.79,4.57 22.25,4.57 22.86,5.18 C16.1 | R17.2 53.95,11.43 57.15,11.43 57.61,11.89 IC5.5 57.76,12.04 57.76,14.94 58.22,15.39 60.5,15.39 64.77,11.12 66.6,11.12 67.36,11.89 | 67.36,11.89 66.29,12.95 IC2.3 | 67.36,11.89 68.73,10.52 68.73,9.75 R16.1 68.89,9.6 v68.89,7.16 | R12.2 83.06,6.1 79.7,6.1 79.55,6.25 78.79,6.25 78.18,5.64 78.18,5.03 79.4,3.81 79.55,3.81 80.16,3.2 80.16,2.44 79.55,1.83 73.91,1.83 73.3,2.44 J5.1 | v61.87,2.29 58.52,2.29 L2.P$1
  Bottom 0.152: 13.26,3.66 13.41,3.66 13.72,3.96 21.18,3.96 v21.79,4.57 | 13.26,3.66 v5.64,3.66 | v61.87,2.29 64.77,2.29 65.68,3.2 | 65.68,3.2 67.97,5.49 68.89,5.49 | 68.89,5.49 70.26,5.49 73.15,2.59 J5.1 | 68.89,5.49 v68.89,7.16 | 13.26,3.66 13.26,1.98 13.56,1.68 59.74,1.68 62.79,4.72 62.79,4.88 63.09,5.18 63.7,5.18 65.68,3.2
VUSB  (via drill 0.35)
  Top 0.152: 20.27,13.41 20.27,13.11 IC6.8 | 20.27,13.41 20.57,13.72 21.95,13.72 22.1,13.56 22.1,13.11 IC6.5 | IC6.8 20.27,12.95 20.27,11.73 20.73,11.28 22.71,11.28 24.23,12.8 25.45,12.8 C10.1 25.6,12.95 26.52,13.87 v28.35,13.87 | v19.81,14.63 20.42,15.24 20.42,18.29 R18.2 | 20.27,13.41 v19.36,13.41 | 20.27,13.41 IC6.8 | C15.1 68.73,17.98 67.97,17.22 60.66,17.22 59.13,18.75 D2.C 58.98,18.75 v57.91,17.68 | v46.79,15.39 46.63,15.24 45.57,15.24 C11.1
  Bottom 0.152: v19.81,14.63 19.81,13.87 v19.36,13.41 | v57.91,17.68 55.63,15.39 v46.79,15.39 40.08,15.39 38.71,14.02 33.22,14.02 33.07,13.87 v28.35,13.87

### Text on the board
Top: piezo-rev-3-7
bPlace: PIEZO | HEADSET | ON | OFF | MIXER | PHONE